# EAGLE design Smarttree_BMS_3.2 (EAGLE 7.3.0)
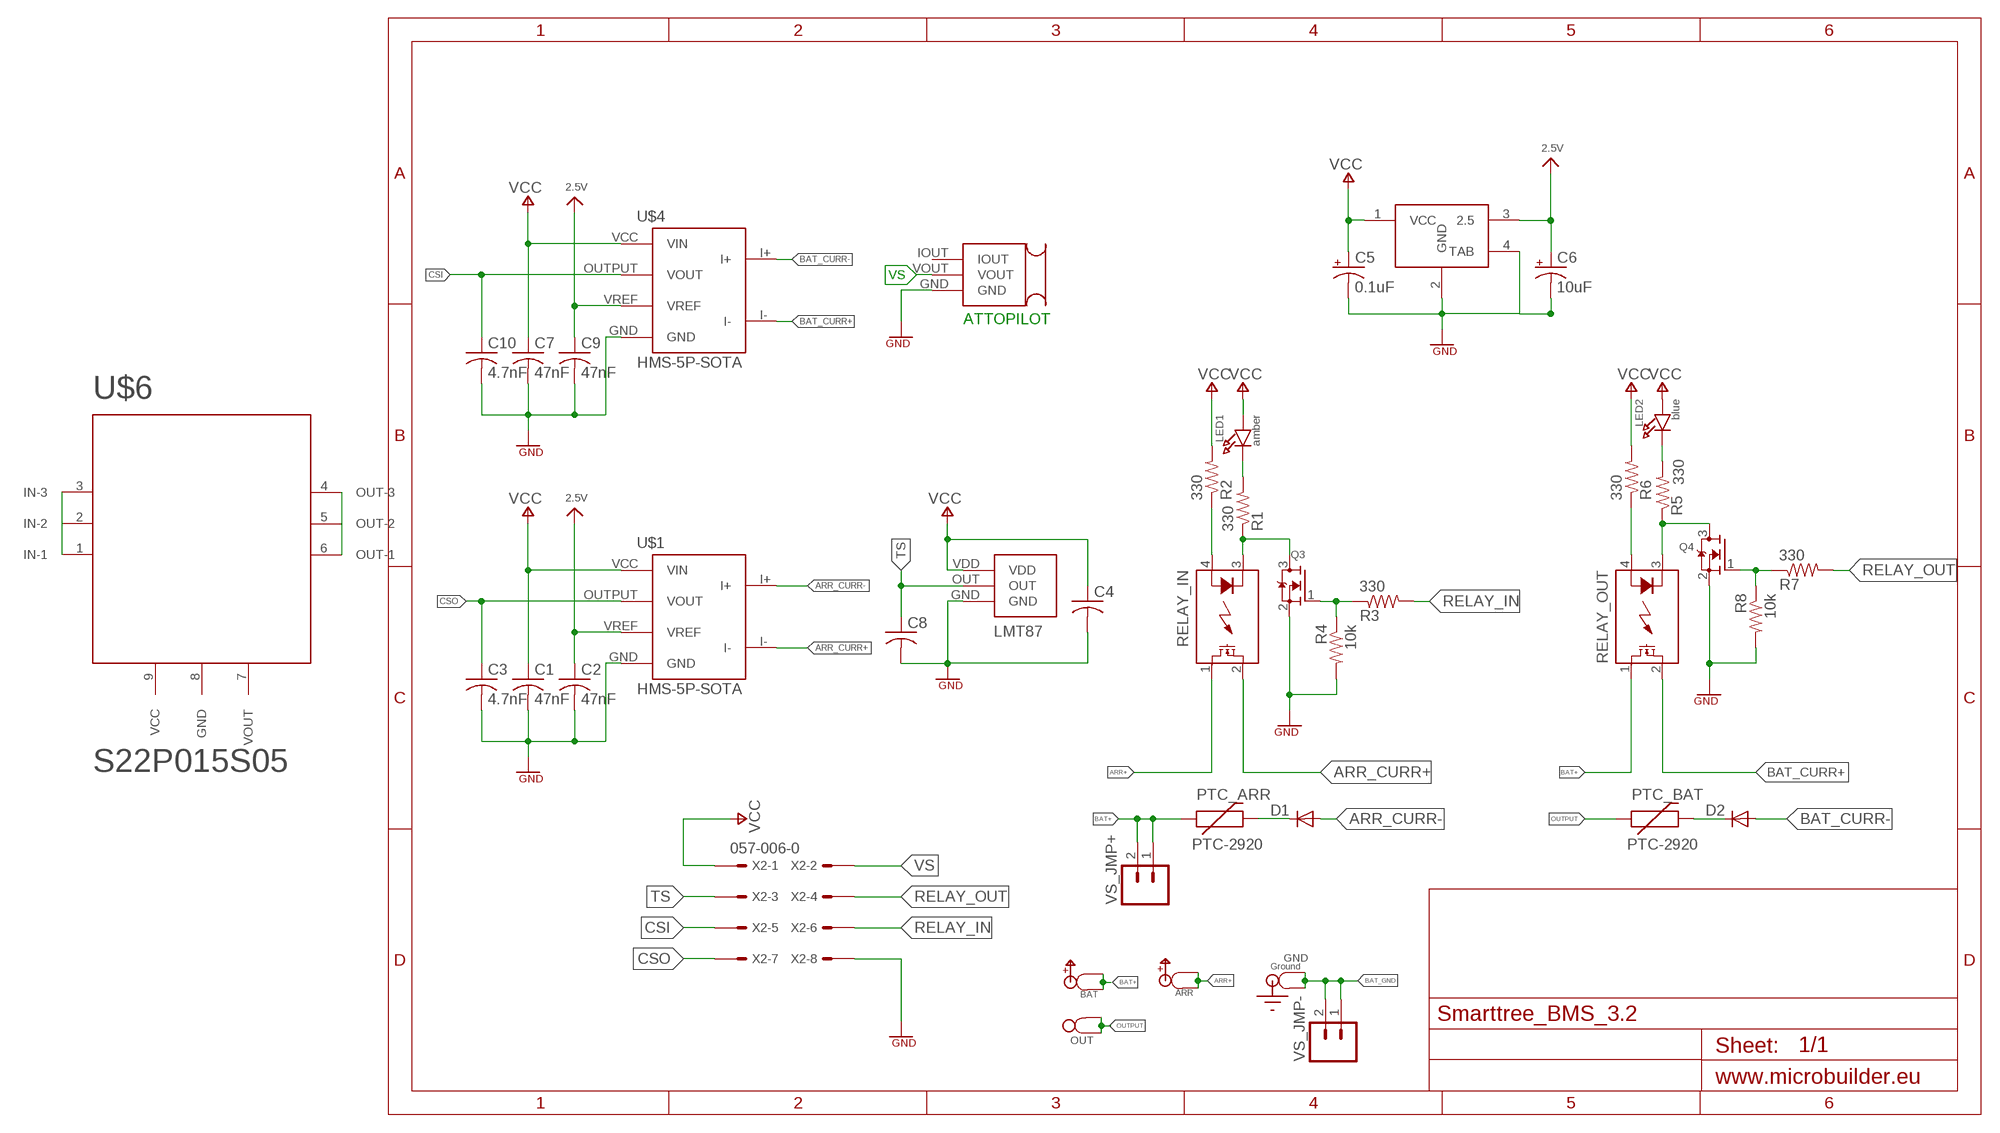
[diagram p0: schematic, sheet 1]

## Parts
ARR  SPADE-POWER  [SPADE-POWER]
ATTOPILOT  ATTOPILOT_VOLT  [TH_BKOT]
BAT  SPADE-POWER  [SPADE-POWER]
C1  47nF  C-USC0805  [C0805]
C2  47nF  C-USC0805  [C0805]
C3  4.7nF  C-USC0805  [C0805]
C4  C-USC0805  [C0805]
C5  0.1uF  10UF-TANT  [EIA3216]
C6  10uF  10UF-TANT  [EIA3216]
C7  47nF  C-USC0805  [C0805]
C8  C-USC0805  [C0805]
C9  47nF  C-USC0805  [C0805]
C10  4.7nF  C-USC0805  [C0805]
D1  DIODE-SOD106-R  [SOD106-R]
D2  DIODE-SOD106-R  [SOD106-R]
GND  SPADE-GROUND  [SPADE-GROUND]
LED1  amber  LED0805  [CHIPLED_0805]
LED2  blue  LED0805  [CHIPLED_0805]
LM1117  LM2937_SOT223  [SOT223]
LMT87  LMT87_PAC  [LMT87_TO]
OUT  SPADE-TERMINALPTH  [SPADE-TERMINAL]
PTC_ARR  PTC-2920  [PTC-2920]
PTC_BAT  PTC-2920  [PTC-2920]
Q3  MOSFET-NREFLOW  [SOT23]
Q4  MOSFET-NREFLOW  [SOT23]
R1  330  R-US_R0805  [R0805]
R2  330  R-US_R0805  [R0805]
R3  330  R-US_R0805  [R0805]
R4  10k  R-US_R0805  [R0805]
R5  330  R-US_R0805  [R0805]
R6  330  R-US_R0805  [R0805]
R7  330  R-US_R0805  [R0805]
R8  10k  R-US_R0805  [R0805]
RELAY_IN  CPC1708J  [I4-PAC]
RELAY_OUT  CPC1708J  [I4-PAC]
U$1  HMS-5P-SOTA  [SMD_CURR_SENSE]
U$4  HMS-5P-SOTA  [SMD_CURR_SENSE]
U$6  S22P015S05  [S22P015S05]
VS_JMP+  M02  [1X02_LONGPADS]
VS_JMP-  M02  [1X02_LONGPADS]
X2  057-006-0  [057-006-0]

## Nets
2.5V: C2.1 C6.A(+) C9.1 LM1117.3(2.5) U$1.VREF U$4.VREF
ARR+ [Power]: ARR.P$1 ARR.P$2 RELAY_IN.1(DS1)
ARR_CURR+ [Power]: RELAY_IN.2(DS2) U$1.I-
ARR_CURR- [Power]: D1.A U$1.I+
BAT+ [Power]: BAT.P$1 BAT.P$2 PTC_ARR.1 RELAY_OUT.1(DS1) VS_JMP+.1 VS_JMP+.2
BAT_CURR+ [Power]: RELAY_OUT.2(DS2) U$4.I-
BAT_CURR-: D2.A U$4.I+
BAT_GND [Power]: GND.P$1 GND.P$2 VS_JMP-.1 VS_JMP-.2
CSI: C10.1 U$4.OUTPUT(VOUT) X2.5
CSO: C3.1 U$1.OUTPUT(VOUT) X2.8
GND: ATTOPILOT.GND C1.2 C2.2 C3.2 C4.2 C5.C(-) C6.C(-) C7.2 C8.2 C9.2 C10.2 LM1117.2(GND) LM1117.4(TAB) LMT87.GND Q3.2(S) Q4.2(S) R4.2 R8.2 U$1.GND U$4.GND X2.7
N$1: Q3.3(D) R1.1 RELAY_IN.3(K)
N$2: Q4.3(D) R5.1 RELAY_OUT.3(K)
N$3: LED1.C R1.2
N$4: R2.1 RELAY_IN.4(A)
N$5: LED2.C R5.2
N$6: Q3.1(G) R3.1 R4.1
N$7: R6.1 RELAY_OUT.4(A)
N$8: Q4.1(G) R7.1 R8.1
N$10 [Power]: D2.C PTC_BAT.2
N$11 [Power]: D1.C PTC_ARR.2
OUTPUT [Power]: OUT.P$1 OUT.P$2 PTC_BAT.1
RELAY_IN: R3.2 X2.6
RELAY_OUT: R7.2 X2.4
TS: C8.1 LMT87.OUT X2.3
VCC: C1.1 C4.1 C5.A(+) C7.1 LED1.A LED2.A LM1117.1(VCC) LMT87.VDD R2.2 R6.2 U$1.VCC(VIN) U$4.VCC(VIN) X2.1 ; supply symbol labelled 5V
VS: ATTOPILOT.VOUT X2.2
Unconnected: ATTOPILOT.IOUT U$6.1(IN-1) U$6.2(IN-2) U$6.3(IN-3) U$6.4(OUT-3) U$6.5(OUT-2) U$6.6(OUT-1) U$6.7(VOUT) U$6.8(GND) U$6.9(VCC)

## Library data of the parts
ARR BAT = Spade-terminals:SPADE-POWER: 0.25" SPADE
ATTOPILOT = Francis-Project:ATTOPILOT_VOLT
C1-C4 C7-C10 = adafruit:C-US: CAPACITOR, American symbol
C5 = SparkFun-Retired:10UF-TANT: 10uF Tantalum SMT CAP-00811- 16V 10% (EIA-3216); PROD_ID: CAP-00811; VALUE: 10uF
C6 = SparkFun-Retired:10UF-TANT: 10uF Tantalum SMT CAP-00811- 16V 10% (EIA-3216); PROD_ID: CAP-00811
D1 D2 = diode:DIODE-: DIODE
GND = Spade-terminals:SPADE-GROUND: 0.25" spade terminal
LED1 LED2 = microbuilder:LED: LED 0603 - 0603 Surface Mount Package 2mA: Green LED - Low Power (3.9mcd, 2ma, 1.7Vf) - Digikey: 475-2709-2-ND Orange LED - Low Power (9.8mcd, 2ma, 1.8Vf) - Digikey: 475-1194-2-ND Red LED - Low Power (5mcd, 2ma, 1.8Vf) - Digikey: 475-1195-2-ND Yellow LED - Low Power (7mcd, 2ma, 1.8Vf) - Digikey: 475-1196-2-ND 5mA: Blue LED - Low Power (17mcd, 5ma, 2.9Vf) - Digikey: LNJ937W8CRACT-ND 0805 - 0805 Surface Mount Package 2mA: Red LED (8.8mcd, 2mA, 1.8Vf, Clear) - Low Power [Digikey: 475-2510-1-ND] Green LED (5mcd, 2mA, 1.8Vf, Clear) - Low Power [Digikey: 475-2730-1-ND] Yellow LED (11.3mcd, 2mA, 1.8Vf, Clear) - Low Power [Digikey: 475-2555-1-ND] 20mA: Red LED (104mcd, 20mA, Diffused) - LS R976 [Digikey: 475-1278-6-ND] Red LED (12mcd, 20mA, 2.0Vf, Clear) - APT2012EC [Digikey: 754-1128-1-ND] Green LED (15mcd, 20mA, 2.2Vf, Clear) - APT2012GC [Digikey: 754-1131-1-ND] Orange LED (160mcd, 20mA, 2.1Vf, Clear) - APT2012SECK [Digikey: 754-1130-1-ND] 1206 - 1206 Surface Mount Package Green LED (26mcd, 20mA, Diffused) - LG N971 [Digikey: 475-1407-6-ND] Red LED (15mcd, 20mA, Diffused) - LH N974 [Digikey: 475-1416-6-ND]
LM1117 = linear2:LM2937_SOT223
LMT87 = nick:LMT87_PAC
OUT = Spade-terminals:SPADE-TERMINAL: 0.25" Spade,with connections for both legs, Pls share any updates with mosaicmerc@yahoo.com
PTC_ARR PTC_BAT = SparkFun:PTC-2920
Q3 Q4 = adafruit:MOSFET-N: N-Channel Mosfet 2N7002E - 60V 260mA SOT23 [Digikey: 2N7002ET1GOSTR-ND] - REEL BSH103 - 30V 850mA SOT23 [Digikey: 568-5013-1-ND]
R1-R8 = adafruit:R-US_: RESISTOR, American symbol
RELAY_IN RELAY_OUT = relay:CPC1708J: Single-Pole, Normally Open i4-PAC (TM) DC Power Relay Source: Data sheet <http://www.clare.com/home/pdfs.nsf/www/CPC1708.pdf/$file/CPC1708.pdf>
U$1 U$4 = Francis-Project:HMS-5P-SOT
U$6 = Allen:S22P015S05
VS_JMP+ VS_JMP- = SparkFun:M02: Header 2 Standard 2-pin 0.1" header. Use with straight break away headers (SKU : PRT-00116), right angle break away headers (PRT-00553), swiss pins (PRT-00743), machine pins (PRT-00117), and female headers (PRT-00115). Molex polarized connector foot print use with SKU : PRT-08233 with associated crimp pins and housings.
X2 = con-panduit:057-006-: CONNECTOR 6-pin series 057 contact pc board low profile headers

## Net classes
0 default: width 0.406 mm, clearance 0.127 mm
1 Power: width 2.54 mm, clearance 0.508 mm

## Board
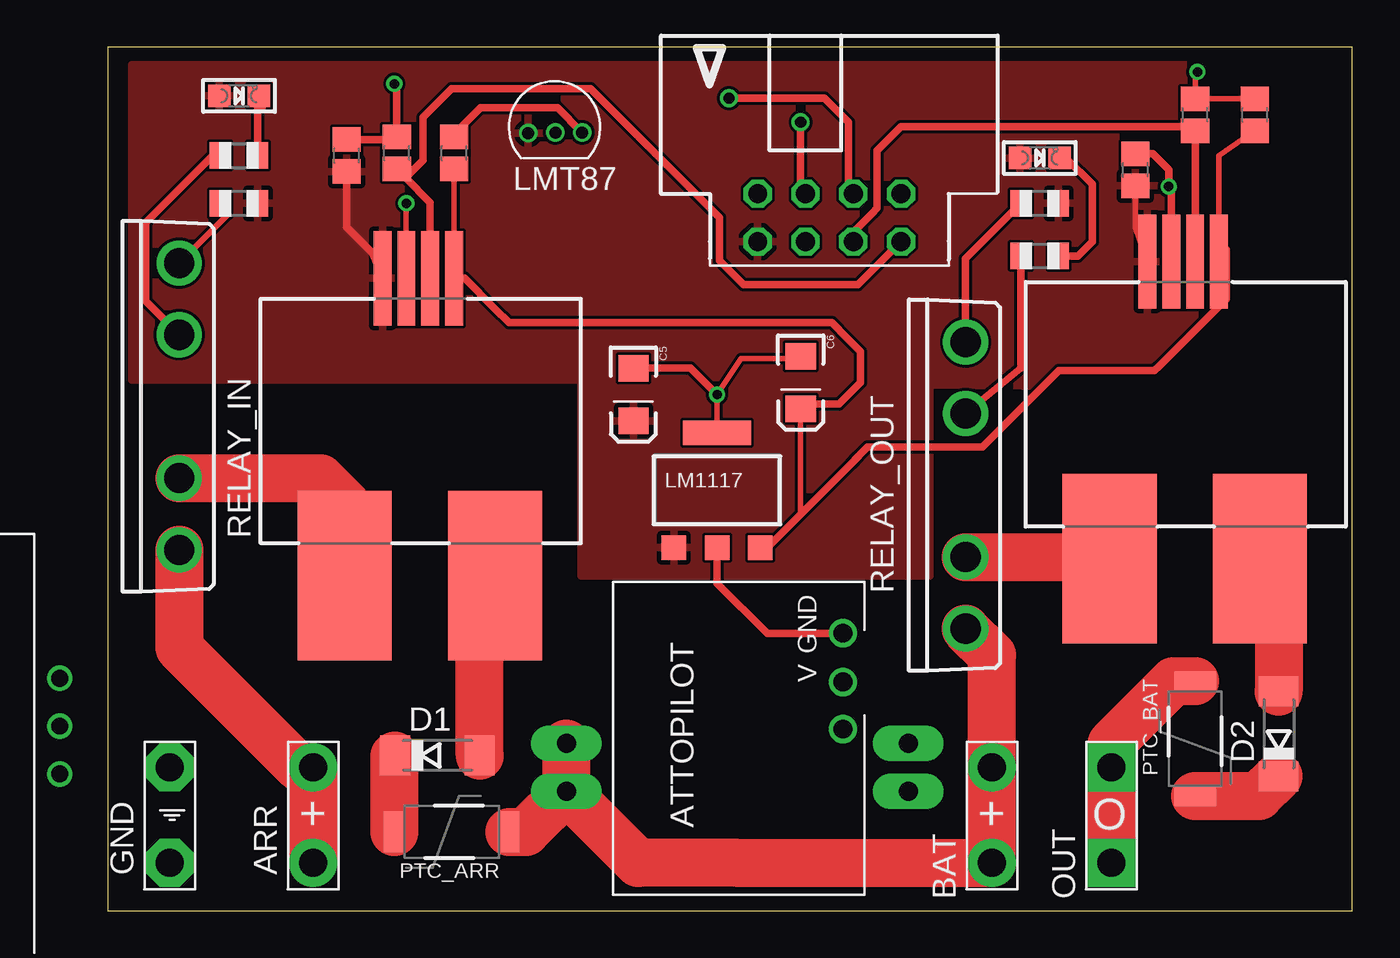
[diagram p1: board, top side]
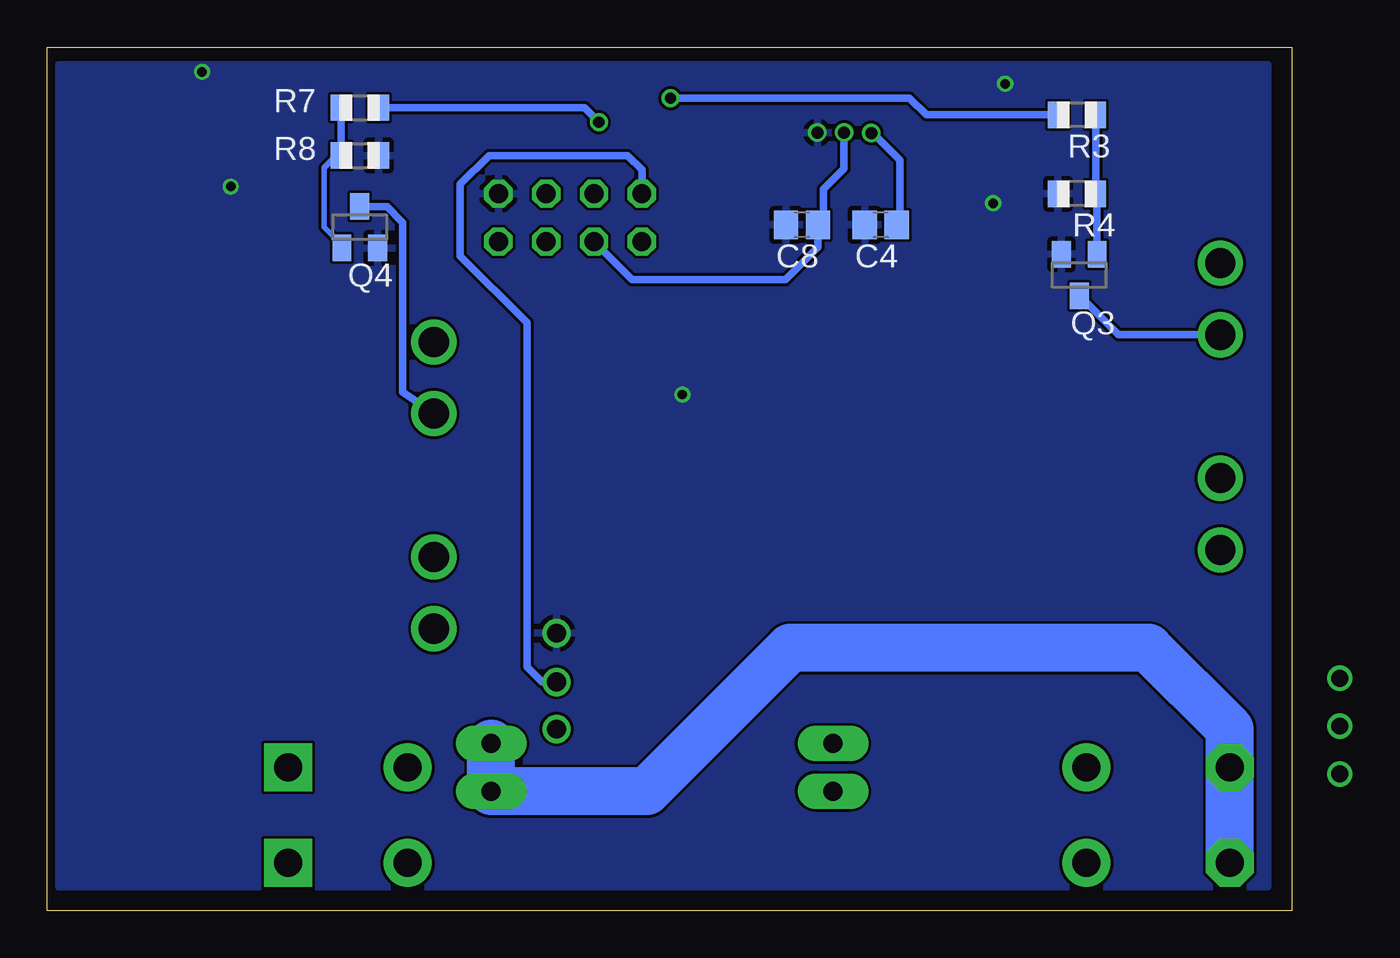
[diagram p2: board, bottom side, seen from below]

Size 66.15 x 45.9 mm. Coordinates in mm from the lower left corner, seen from the top.
Outline: 0,0 66.15,0 66.15,45.9 0,45.9 0,0
Copper layers (1*16): Top 0.0356mm / dielectric 1.5011mm / Bottom 0.0356mm
Design rules "LaenPCBOrder": minimum track width 6mil, minimum drill 13mil, track to track 6mil, track to pad 6mil, pad to pad 6mil, via to via 6mil, smd to smd 6mil, copper to edge 15mil, drill to drill 6mil, minimum pad ring 7mil, minimum via ring 7mil, stop-mask expansion 3mil, vias tented up to drill 0mil, thermal gap 10mil

### Footprints (pad centres in the part's own frame; a part is rotated, then mirrored left to right if it is on the bottom)
SPADE-POWER = drill 1.5 pad 2.54: P$1 0,-2.54; P$2 0,2.54
TH_BKOT = drill 1: GND 5.1,-4.4; IOUT 0,-4.4; VOUT 2.5,-4.4
C0805 = smd 1.3 x 1.5: 1 -0.85,0; 2 0.85,0
EIA3216 = smd 1.4 x 1.6: A 1.4,0; C -1.4,0
SOD106-R = smd 1.6 x 2.1: A 2.25,0; C -2.25,0
SPADE-GROUND = drill 1.5 pad 2.54 octagon: P$1 0,-2.54; P$2 0,2.54
CHIPLED_0805 = smd 1.2 x 1.2: A 0,-1.05; C 0,1.05
SOT223 = smd 1.3 x 1.3: 1 -2.3,-3.05; 2 0,-3.05; 3 2.3,-3.05 | smd 3.6 x 1.3: 4 0,3.05
LMT87_TO = drill 0.635: GND 0.305,-1.346; OUT 1.727,-1.346; VDD 3.175,-1.321
SPADE-TERMINAL = drill 1.5 pad 2.54 square: P$1 0,-2.54; P$2 0,2.54
PTC-2920 = smd 1.067 x 2.184: 1 -2.032,0.638; 2 4.064,0.638
SOT23 = smd 1 x 1.4: 1 -0.95,-1.1; 2 0.95,-1.1; 3 0,1.1
R0805 = smd 1.1 x 1.4: 1 -1,0; 2 1,0
I4-PAC = drill 1.6 pad 2.3: 1 -7.62,0; 2 -3.81,0; 3 3.81,0; 4 7.62,0
SMD_CURR_SENSE = smd 5 x 0.95: GND -8.08,-1.27; OUTPUT -8.08,0; VCC -8.08,-2.54; VREF -8.08,1.27 | smd 9 x 5: I+ 7.715,3.445; I- 7.715,-4.54
S22P015S05 = drill 0.9: 1 -6.35,-1.62; 2 -6.35,0.92; 3 -6.35,3.46; 4 6.35,3.46; 5 6.35,0.92; 6 6.35,-1.62 | drill 0.6: 7 2.54,-9.22; 8 0,-9.22; 9 -2.54,-9.22
1X02_LONGPADS = drill 1.016 pad 1.88 long: 1 0,0; 2 2.54,0
057-006-0 = drill 1 octagon: 1 -2.54,-5.08; 2 -2.54,-2.54; 3 0,-5.08; 4 0,-2.54; 5 2.54,-5.08; 6 2.54,-2.54; 7 5.08,-2.54; 8 5.08,-5.08

### Placement (x,y rotation side)
ARR  10.92,5.08 0 top
ATTOPILOT  34.67,9.65 90 top
BAT  46.99,5.08 0 top
C1  12.7,40.13 90 top
C2  18.41,40.26 90 top
C3  15.37,40.26 90 top
C4  21.84,36.45 180 bottom
C5  27.94,27.43 270 top
C6  36.83,28.07 270 top
C7  54.61,39.37 90 top
C8  26.04,36.45 180 bottom
C9  60.96,42.29 90 top
C10  57.78,42.29 90 top
D1  17.53,8.26 0 top
D2  62.23,9.4 90 top
GND  3.3,5.08 0 top
LED1  6.99,43.31 270 top
LED2  49.53,40.01 270 top
LM1117  32.38,22.35 0 top
LMT87  25.53,40.01 180 top
OUT  53.34,5.08 0 top
PTC_ARR  19.3,4.83 180 top
PTC_BAT  57.15,10.16 270 top
Q3  11.3,33.78 180 bottom
Q4  49.53,36.32 0 bottom
R1  6.99,40.13 0 top
R2  6.99,37.59 0 top
R3  11.43,42.29 180 bottom
R4  11.43,38.1 180 bottom
R5  49.53,34.8 0 top
R6  49.53,37.59 0 top
R7  49.53,42.67 0 bottom
R8  49.53,40.13 0 bottom
RELAY_IN  3.81,26.8 90 top
RELAY_OUT  45.59,22.61 90 top
U$1  17.14,25.53 270 top
U$4  57.78,26.42 270 top
U$6  -8.89,8.89 0 top
VS_JMP+  24.38,6.35 90 top
VS_JMP-  42.55,6.35 90 top
X2  37.08,40.64 0 top

### Tracks (layer width: path | path; a pad name or v marks a point on that pad's centre or on a via)
2.5V
  Top 0.305: U$1.VREF 18.41,38.23 C2.1 | U$4.VREF 59.05,40.13 C9.1 | LM1117.3 34.92,19.18 | 36.58,20.83 36.83,21.08 36.83,26.16 C6.A
  Top 0.406: U$1.VREF 18.97,33.61 20.57,32 21.34,31.24 38.48,31.24 39.31,30.42 | 39.05,30.67 39.31,30.42 | 39.31,30.42 40.01,29.72 40.01,28.19 40.01,28.07 38.86,26.92 37.09,26.92 C6.A | U$4.VREF 59.44,35.13 59.44,32.51 57.66,30.73 55.88,28.96 55.63,28.7 50.55,28.7 46.48,24.64 40.39,24.64 39.5,23.75 | 39.88,24.13 39.5,23.75 | 39.5,23.75 36.58,20.83 34.92,19.18
ARR+
  Top 2.54: RELAY_IN.1 3.81,13.97 10.16,7.62 ARR.P$2 ARR.P$1
ARR_CURR+
  Top 2.54: RELAY_IN.2 11.3,22.99 12.7,21.59 12.7,17.91 U$1.I-
ARR_CURR-
  Top 2.54: D1.A 19.78,18.51 20.32,19.05 20.32,18.08 U$1.I+
BAT+
  Top 2.54: VS_JMP+.1 28.19,2.54 33.53,2.54 BAT.P$1 BAT.P$2 46.99,13.59 RELAY_OUT.1 | VS_JMP+.1 VS_JMP+.2 | PTC_ARR.1 22.22,4.19 VS_JMP+.1
BAT_CURR+
  Top 2.54: RELAY_OUT.2 53.15,18.8 U$4.I-
BAT_CURR-
  Top 2.54: U$4.I+ 62.23,17.7 D2.A
BAT_GND
  Bottom 2.54: GND.P$2 GND.P$1 3.3,9.65 7.62,13.97 26.67,13.97 34.29,6.35 VS_JMP-.1 VS_JMP-.2
CSI
  Top 0.406: U$4.OUTPUT C10.1 57.57,41.66 42.16,41.66 41.66,41.15 40.89,40.39 40.89,39.88 40.89,37.34 40.64,37.08 39.62,36.07 X2.5
CSO
  Top 0.406: U$1.OUTPUT 17.14,37.63 15.83,38.95 | 15.83,38.95 C3.1 | 15.83,38.95 16.76,39.88 16.76,42.16 18.29,43.69 25.65,43.69 32.51,36.83 32.51,34.54 33.78,33.27 39.88,33.27 X2.8
GND  (via drill 0.5)
  Top 0.305: v15.88,37.59 15.88,33.78 U$1.GND | C6.C 36.83,29.34 33.66,29.34 v32.38,27.43 LM1117.4 | C9.2 C10.2 57.78,44.58 v57.91,44.58
  Top 0.406: C1.2 15.24,40.98 C3.2 15.37,42.16 15.37,43.81 v15.24,43.94 | C5.C 30.98,28.83 v32.38,27.43 | C2.2 18.41,41.27 19.81,42.67 23.9,42.67 LMT87.GND | LM1117.2 32.38,17.4 35.05,14.73 39.05,14.73 ATTOPILOT.GND | U$4.GND 56.52,38.35 v56.39,38.48 56.39,39.37 55.54,40.22 C7.2
  pour Bottom: 1.27,44.96 1.27,1.27 65.53,1.27 65.53,44.96
N$1
  Top 0.406: R1.1 5.59,40.13 2.03,36.58 2.03,32.38 RELAY_IN.3
  Bottom 0.406: RELAY_IN.3 9.23,30.61 Q3.3
N$2
  Top 0.406: R5.1 48.53,28.84 RELAY_OUT.3
  Bottom 0.406: Q4.3 48.09,37.42 47.24,36.58 47.24,27.56 RELAY_OUT.3
N$3
  Top 0.305: LED1.C 8.26,42.67
  Top 0.406: R1.2 7.99,43.26 LED1.C
N$4
  Top 0.305: R2.1 6.35,36.96 RELAY_IN.4
N$5
  Top 0.406: LED2.C 50.93,40.01 52.32,38.61 52.32,35.56 51.56,34.8 R5.2
N$6
  Bottom 0.406: Q3.1 10.35,38.02 R4.1 R3.1
N$7
  Top 0.406: RELAY_OUT.4 45.59,34.66 R6.1
N$8
  Bottom 0.305: R8.1 50.8,40.13 51.44,39.5 51.44,36.32 50.35,35.24 50.16,35.05
  Bottom 0.406: Q4.1 50.38,35.22 50.35,35.24 | R7.1 R8.1
N$10
  Top 2.54: PTC_BAT.2 61.18,6.1 D2.C
N$11
  Top 2.54: PTC_ARR.2 15.24,8.22 D1.C
OUTPUT
  Top 2.54: OUT.P$1 OUT.P$2 53.34,8.89 56.64,12.19 PTC_BAT.1
RELAY_IN  (via drill 0.6)
  Top 0.406: v33.02,43.18 36.83,43.18 38.1,43.18 39.37,41.91 39.37,38.35 X2.6
  Bottom 0.406: R3.2 19.43,42.29 20.32,43.18 v33.02,43.18
RELAY_OUT  (via drill 0.6)
  Top 0.406: v36.83,41.91 36.83,38.35 X2.4
  Bottom 0.406: R7.2 37.59,42.67 v36.83,41.91
TS
  Bottom 0.406: LMT87.OUT 23.8,39.45 24.89,38.35 24.89,36.74 C8.1 25.18,35.27 26.92,33.53 35.05,33.53 X2.3
VCC
  Top 0.305: 13.97,35.05 U$1.VCC | C7.1 54.61,36.32 U$4.VCC
  Top 0.406: C1.1 12.7,36.32 13.97,35.05 | U$1.VCC 14.61,33.4 14.73,33.27
  Bottom 0.406: LMT87.VDD 22.28,41.33 20.83,39.88 20.83,36.62 C4.1
  pour Top: 1.27,44.96 1.27,28.19 25.15,28.19 25.15,17.78 43.69,17.78 43.69,27.94 65.53,27.69 65.53,44.96
VS
  Bottom 0.406: ATTOPILOT.VOUT 39.84,12.15 40.51,12.83 40.64,12.95 40.64,31.24 44.2,34.8 44.2,38.61 42.67,40.13 35.31,40.13 34.54,39.37 X2.2

### Text on the board
Document: Digital Isolator (optocoupler) for Voltage sensor / Spacing of spade terminal